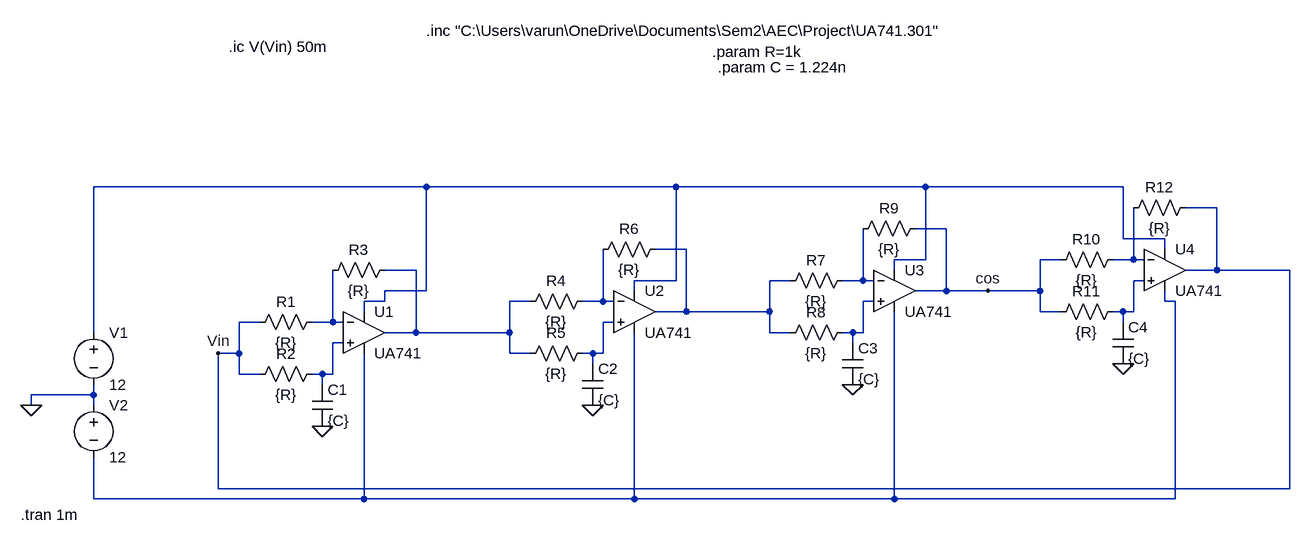
[diagram p0: schematic V3.asc]
V3.asc, the LTspice schematic file:
Version 4
SHEET 1 1636 680
WIRE 304 -688 -208 -688
WIRE 688 -688 304 -688
WIRE 1072 -688 688 -688
WIRE 1376 -688 1072 -688
WIRE 1520 -656 1472 -656
WIRE 1104 -624 1056 -624
WIRE 1376 -608 1376 -688
WIRE 1440 -608 1376 -608
WIRE 704 -592 656 -592
WIRE 1440 -592 1440 -608
WIRE 1072 -576 1072 -688
WIRE 1072 -576 1024 -576
WIRE 1280 -576 1248 -576
WIRE 1392 -576 1392 -656
WIRE 1392 -576 1360 -576
WIRE 1408 -576 1392 -576
WIRE 288 -560 240 -560
WIRE 1024 -560 1024 -576
WIRE 1520 -560 1520 -656
WIRE 1520 -560 1472 -560
WIRE 1632 -560 1520 -560
WIRE 688 -544 688 -688
WIRE 688 -544 624 -544
WIRE 864 -544 832 -544
WIRE 976 -544 976 -624
WIRE 976 -544 944 -544
WIRE 992 -544 976 -544
WIRE 1408 -544 1392 -544
WIRE 304 -528 304 -688
WIRE 304 -528 240 -528
WIRE 624 -528 624 -544
WIRE 1104 -528 1104 -624
WIRE 1104 -528 1056 -528
WIRE 1168 -528 1104 -528
WIRE 1248 -528 1248 -576
WIRE 1248 -528 1168 -528
WIRE 240 -512 240 -528
WIRE 240 -512 208 -512
WIRE 464 -512 432 -512
WIRE 576 -512 576 -592
WIRE 576 -512 544 -512
WIRE 592 -512 576 -512
WIRE 992 -512 976 -512
WIRE 1440 -512 1440 -528
WIRE 1456 -512 1440 -512
WIRE 208 -496 208 -512
WIRE 704 -496 704 -592
WIRE 704 -496 656 -496
WIRE 832 -496 832 -544
WIRE 832 -496 704 -496
WIRE 1248 -496 1248 -528
WIRE 1280 -496 1248 -496
WIRE 1376 -496 1360 -496
WIRE 1392 -496 1392 -544
WIRE 1392 -496 1376 -496
WIRE 48 -480 16 -480
WIRE 160 -480 160 -560
WIRE 160 -480 128 -480
WIRE 176 -480 160 -480
WIRE 592 -480 576 -480
WIRE 1376 -480 1376 -496
WIRE -208 -464 -208 -688
WIRE 288 -464 288 -560
WIRE 288 -464 240 -464
WIRE 432 -464 432 -512
WIRE 432 -464 288 -464
WIRE 832 -464 832 -496
WIRE 864 -464 832 -464
WIRE 960 -464 944 -464
WIRE 976 -464 976 -512
WIRE 976 -464 960 -464
WIRE 176 -448 160 -448
WIRE 960 -448 960 -464
WIRE 16 -432 16 -480
WIRE 16 -432 -16 -432
WIRE 432 -432 432 -464
WIRE 464 -432 432 -432
WIRE 560 -432 544 -432
WIRE 576 -432 576 -480
WIRE 576 -432 560 -432
WIRE 560 -416 560 -432
WIRE 16 -400 16 -432
WIRE 48 -400 16 -400
WIRE 144 -400 128 -400
WIRE 160 -400 160 -448
WIRE 160 -400 144 -400
WIRE 144 -384 144 -400
WIRE -208 -368 -208 -384
WIRE -208 -368 -304 -368
WIRE -304 -352 -304 -368
WIRE -208 -352 -208 -368
WIRE -16 -224 -16 -432
WIRE 1632 -224 1632 -560
WIRE 1632 -224 -16 -224
WIRE -208 -208 -208 -272
WIRE 208 -208 208 -432
WIRE 208 -208 -208 -208
WIRE 624 -208 624 -464
WIRE 624 -208 208 -208
WIRE 1024 -208 1024 -496
WIRE 1024 -208 624 -208
WIRE 1456 -208 1456 -512
WIRE 1456 -208 1024 -208
FLAG 144 -320 0
FLAG 560 -352 0
FLAG 960 -384 0
FLAG 1376 -416 0
FLAG -304 -352 0
FLAG -16 -432 Vin
FLAG 1168 -528 cos
SYMBOL OpAmps\\opamp2 208 -528 R0
SYMATTR InstName U1
SYMATTR Value UA741
SYMBOL res 144 -496 R90
WINDOW 0 0 56 VBottom 2
WINDOW 3 32 56 VTop 2
SYMATTR InstName R1
SYMATTR Value {R}
SYMBOL res 144 -416 R90
WINDOW 0 0 56 VBottom 2
WINDOW 3 32 56 VTop 2
SYMATTR InstName R2
SYMATTR Value {R}
SYMBOL cap 128 -384 R0
SYMATTR InstName C1
SYMATTR Value {C}
SYMBOL res 256 -576 R90
WINDOW 0 0 56 VBottom 2
WINDOW 3 32 56 VTop 2
SYMATTR InstName R3
SYMATTR Value {R}
SYMBOL OpAmps\\opamp2 624 -560 R0
SYMATTR InstName U2
SYMATTR Value UA741
SYMBOL res 560 -528 R90
WINDOW 0 0 56 VBottom 2
WINDOW 3 32 56 VTop 2
SYMATTR InstName R4
SYMATTR Value {R}
SYMBOL res 560 -448 R90
WINDOW 0 0 56 VBottom 2
WINDOW 3 32 56 VTop 2
SYMATTR InstName R5
SYMATTR Value {R}
SYMBOL cap 544 -416 R0
SYMATTR InstName C2
SYMATTR Value {C}
SYMBOL res 672 -608 R90
WINDOW 0 0 56 VBottom 2
WINDOW 3 32 56 VTop 2
SYMATTR InstName R6
SYMATTR Value {R}
SYMBOL OpAmps\\opamp2 1024 -592 R0
SYMATTR InstName U3
SYMATTR Value UA741
SYMBOL res 960 -560 R90
WINDOW 0 0 56 VBottom 2
WINDOW 3 32 56 VTop 2
SYMATTR InstName R7
SYMATTR Value {R}
SYMBOL res 960 -480 R90
WINDOW 0 0 56 VBottom 2
WINDOW 3 32 56 VTop 2
SYMATTR InstName R8
SYMATTR Value {R}
SYMBOL cap 944 -448 R0
SYMATTR InstName C3
SYMATTR Value {C}
SYMBOL res 1072 -640 R90
WINDOW 0 0 56 VBottom 2
WINDOW 3 32 56 VTop 2
SYMATTR InstName R9
SYMATTR Value {R}
SYMBOL OpAmps\\opamp2 1440 -624 R0
SYMATTR InstName U4
SYMATTR Value UA741
SYMBOL res 1376 -592 R90
WINDOW 0 0 56 VBottom 2
WINDOW 3 32 56 VTop 2
SYMATTR InstName R10
SYMATTR Value {R}
SYMBOL res 1376 -512 R90
WINDOW 0 0 56 VBottom 2
WINDOW 3 32 56 VTop 2
SYMATTR InstName R11
SYMATTR Value {R}
SYMBOL cap 1360 -480 R0
SYMATTR InstName C4
SYMATTR Value {C}
SYMBOL res 1488 -672 R90
WINDOW 0 0 56 VBottom 2
WINDOW 3 32 56 VTop 2
SYMATTR InstName R12
SYMATTR Value {R}
SYMBOL voltage -208 -480 R0
SYMATTR InstName V1
SYMATTR Value 12
SYMBOL voltage -208 -368 R0
SYMATTR InstName V2
SYMATTR Value 12
TEXT 304 -928 Left 2 !.inc "C:\\Users\\varun\\OneDrive\\Documents\\Sem2\\AEC\\Project\\UA741.301"
TEXT 744 -896 Left 2 !.param R=1k
TEXT 752 -872 Left 2 !.param C = 1.224n
TEXT -320 -184 Left 2 !.tran 1m
TEXT 0 -904 Left 2 !.ic V(Vin) 50m

The netlist it stands for:
* V3.asc
XU1 N012 N010 N001 N009 N004 UA741  ; pins In+ In- V+ V- OUT
R1 N010 Vin {R}
R2 N012 Vin {R}
C1 N012 0 {C}
R3 N004 N010 {R}
XU2 N011 N007 N001 N009 N002 UA741  ; pins In+ In- V+ V- OUT
R4 N007 N004 {R}
R5 N011 N004 {R}
C2 N011 0 {C}
R6 N002 N007 {R}
XU3 N008 N005 N001 N009 cos UA741  ; pins In+ In- V+ V- OUT
R7 N005 N002 {R}
R8 N008 N002 {R}
C3 N008 0 {C}
R9 cos N005 {R}
XU4 N006 N003 N001 N009 Vin UA741  ; pins In+ In- V+ V- OUT
R10 N003 cos {R}
R11 N006 cos {R}
C4 N006 0 {C}
R12 Vin N003 {R}
V1 N001 0 12
V2 0 N009 12
.inc "C:\Users\varun\OneDrive\Documents\Sem2\AEC\Project\UA741.301"
.param R=1k
.param C = 1.224n
.tran 1m
.ic V(Vin) 50m
.backanno
.end